# EasyEDA schematic Elektronisch schema PCB.json
TITLE: Linefollower; REV: 1.0; Date: 2023-11-24; Sheet: 1/1; Drawn By: joren.verdegem; Company: HOGENT
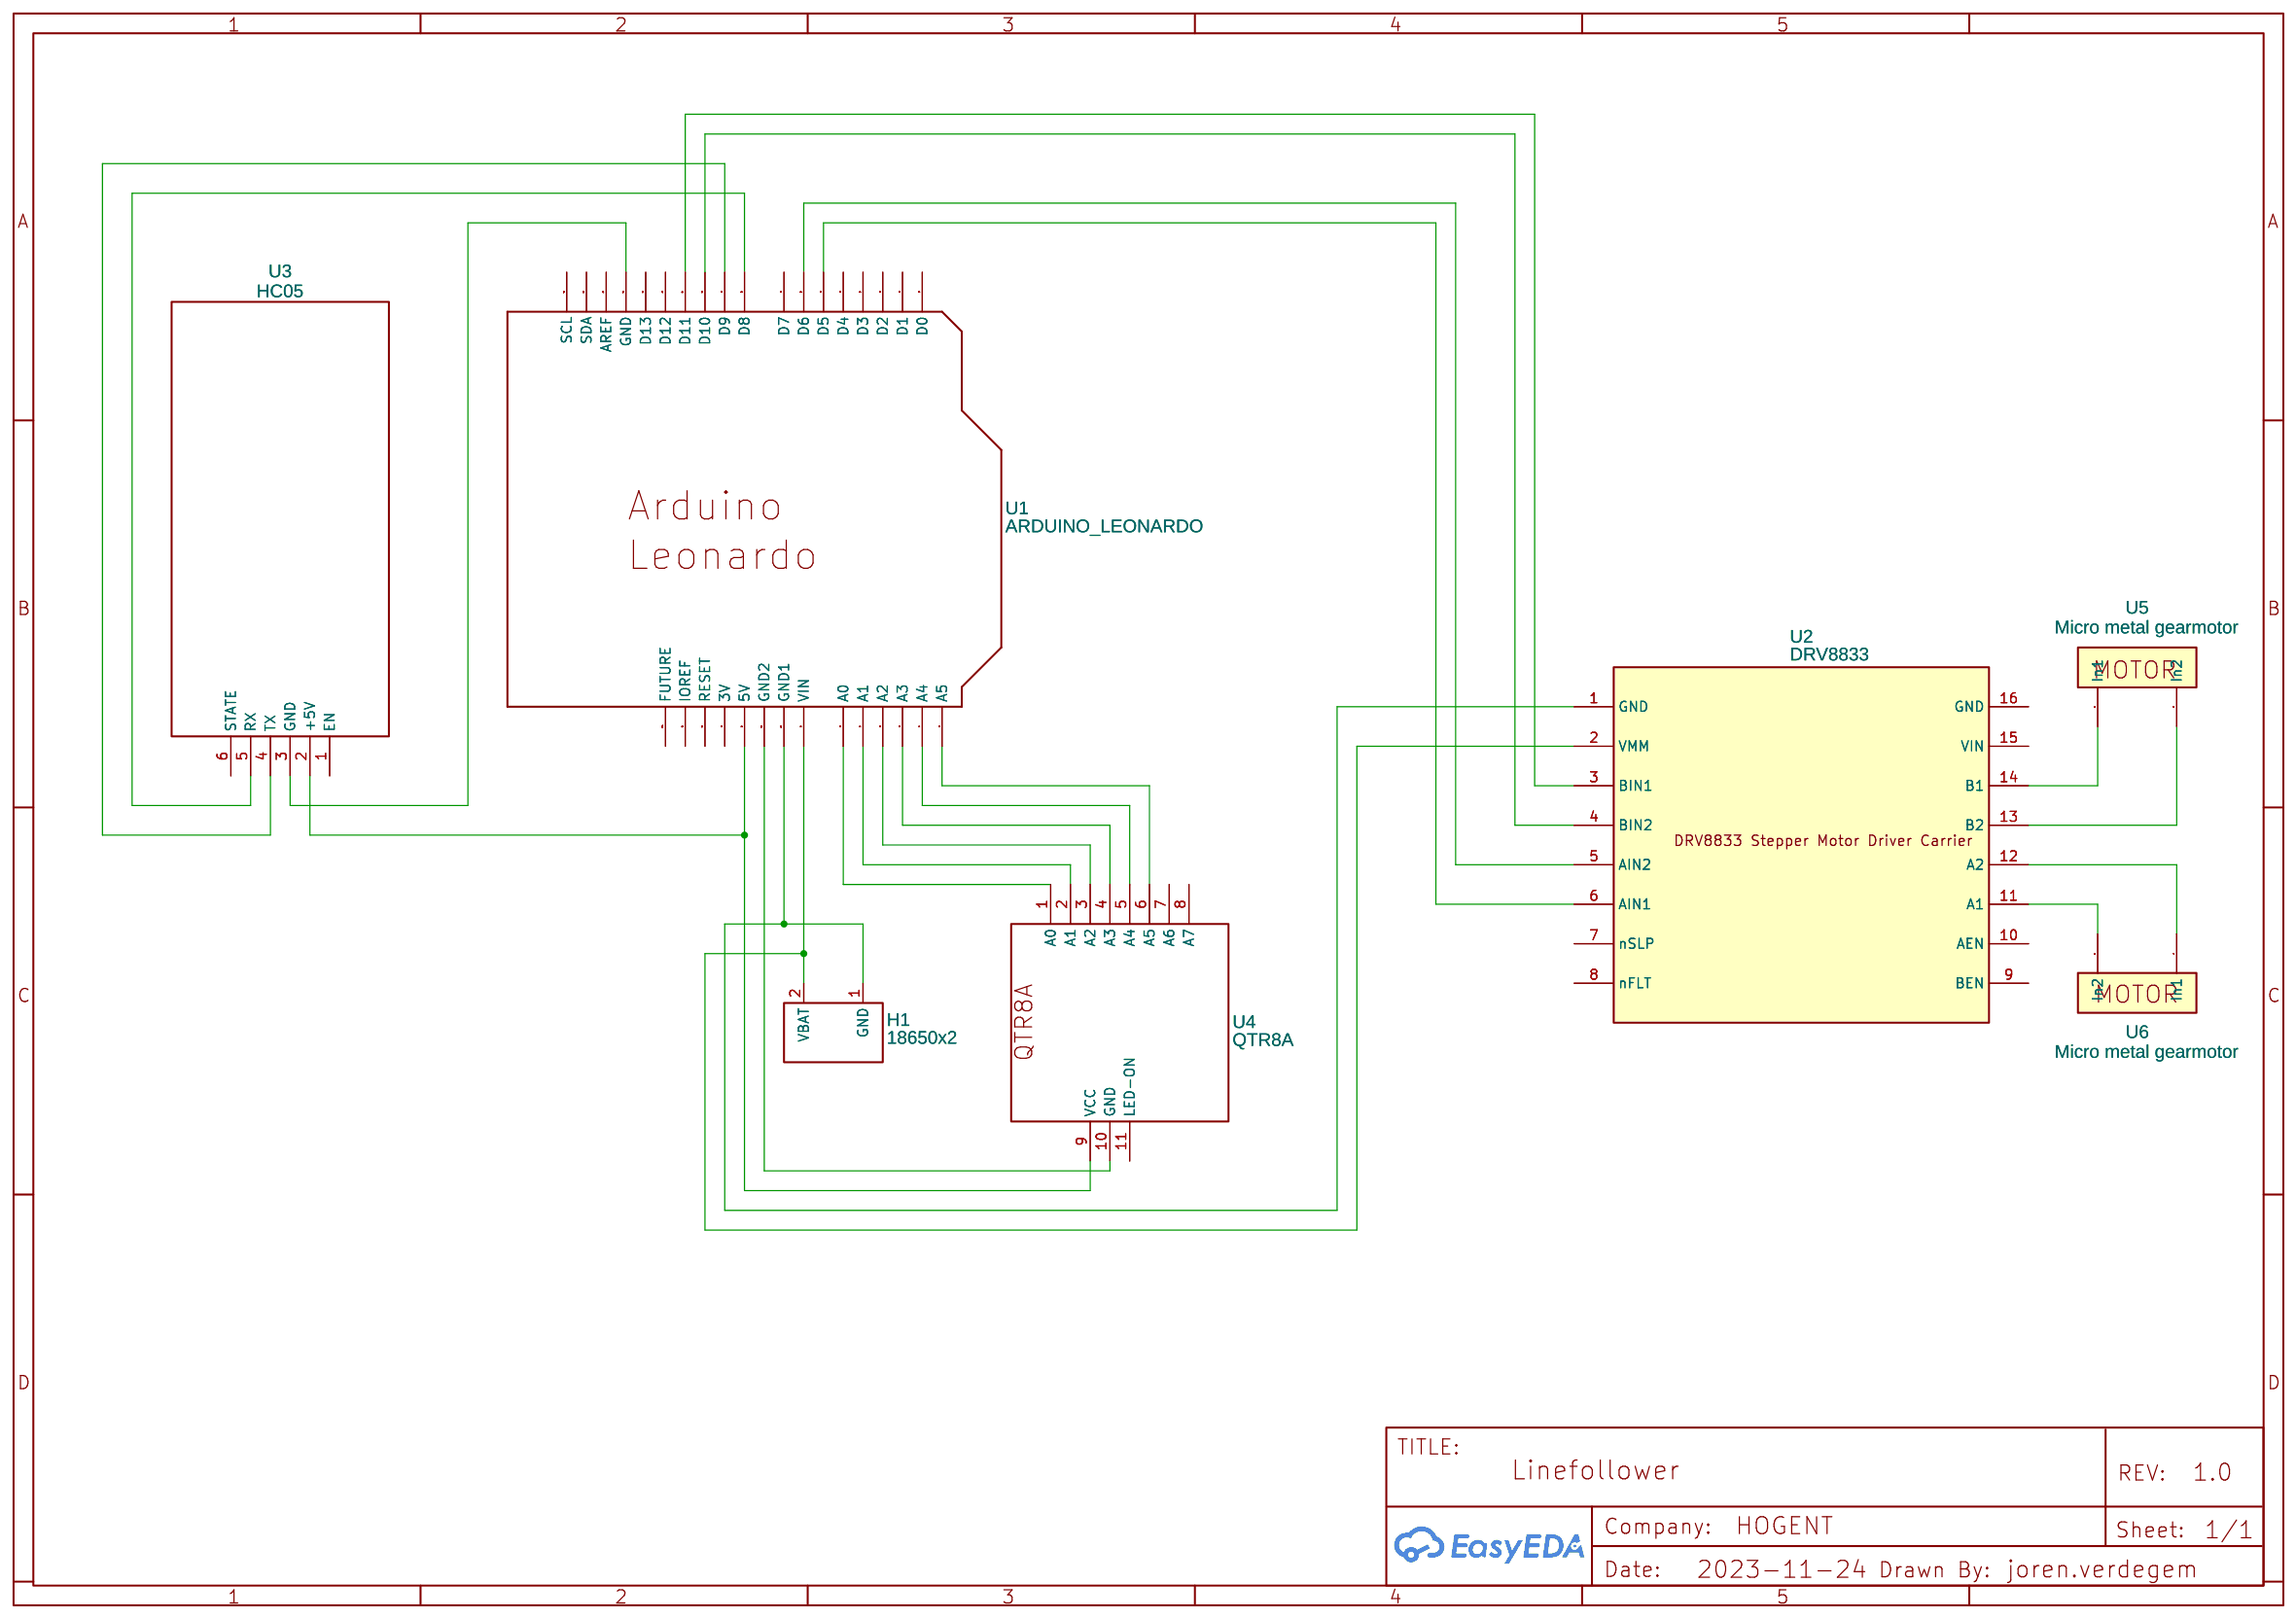
[diagram p0: schematic sheet]

## Parts
H1  18650x2  [H18650]
U1  ARDUINO_LEONARDO  [ARDUINO_LEONARDO]
U2  DRV8833  [DRV8833 DUAL MOTOR DRIVER CARRIER]
U3  HC05  [HC-05]
U4  QTR8A  [QTR8A]
U5  Micro metal gearmotor  [MICRO METAL GEAR MOTOR]
U6  Micro metal gearmotor  [MICRO METAL GEAR MOTOR]

## Library data of the parts
H1 = 18650x2: Contributor: GoncharovBoris
U1 = ARDUINO_LEONARDO
U2 = DRV8833 Stepper Motor Driver Carrier: Contributor: winter2015; sourceId: YsmgyP7pj
U3 = HC05: Contributor: ageeff169
U4 = SCHLIB_QTR8A_2023-02-18: Manufacturer: POLOLU; Supplier: POLOLU; link: https://www.pololu.com/product/960/pictures; Contributor: joseaquinorojas
U5 U6 = Micro metal gearmotor: Manufacturer: Pololu; Manufacturer Part: 3062; Supplier: Pololu; Supplier Part: 3062; link: https://www.pololu.com/product/3062; Contributor: roger_maister

## Nets
Net-(H1-1): H1.1(GND) U1.GND$3(GND1) U2.1(GND)
Net-(H1-2): H1.2(VBAT) U1.VIN U2.2(VMM)
Net-(U1-5V): U1.5V U3.2(+5V) U4.9(VCC)
Net-(U1-A0): U1.A0 U4.1(A0)
Net-(U1-A1): U1.A1 U4.2(A1)
Net-(U1-A2): U1.A2 U4.3(A2)
Net-(U1-A3): U1.A3 U4.4(A3)
Net-(U1-A4): U1.A4 U4.5(A4)
Net-(U1-A5): U1.A5 U4.6(A5)
Net-(U1-D5): U1.D5 U2.6(AIN1)
Net-(U1-D6): U1.D6 U2.5(AIN2)
Net-(U1-D8): U1.D8 U3.5(RX)
Net-(U1-D9): U1.D9 U3.4(TX)
Net-(U1-D10): U1.D10 U2.4(BIN2)
Net-(U1-D11): U1.D11 U2.3(BIN1)
Net-(U1-GND$2): U1.GND$2(GND2) U4.10(GND)
Net-(U1-GND): U1.GND U3.3(GND)
Net-(U2-11): U2.11(A1) U6.2(In2)
Net-(U2-12): U2.12(A2) U6.1(In1)
Net-(U2-13): U2.13(B2) U5.2(In2)
Net-(U2-14): U2.14(B1) U5.1(In1)

Not connected (* = marked no-connect by the designer): U1 3V AREF D0 D1 D2 D3 D4 D7 D12 D13 IOREF RESERVED(FUTURE) RESET SCL SDA; U2 7(nSLP) 8(nFLT) 9(BEN) 10(AEN) 15(VIN) 16(GND); U3 1(EN) 6(STATE); U4 7(A6) 8(A7) 11(LED-ON)
